# Altium schematic sheet Project_Information.SchDoc: =project_title
size Tabloid; CompanyName: Luxonis Holding; Organization: Luxonis Holding; Address1: 1925 Harmony Park Drive; Address2: Westminster, CO; Address3: 80234; Address4: United States; SheetNumber: 1; SheetTotal: 9
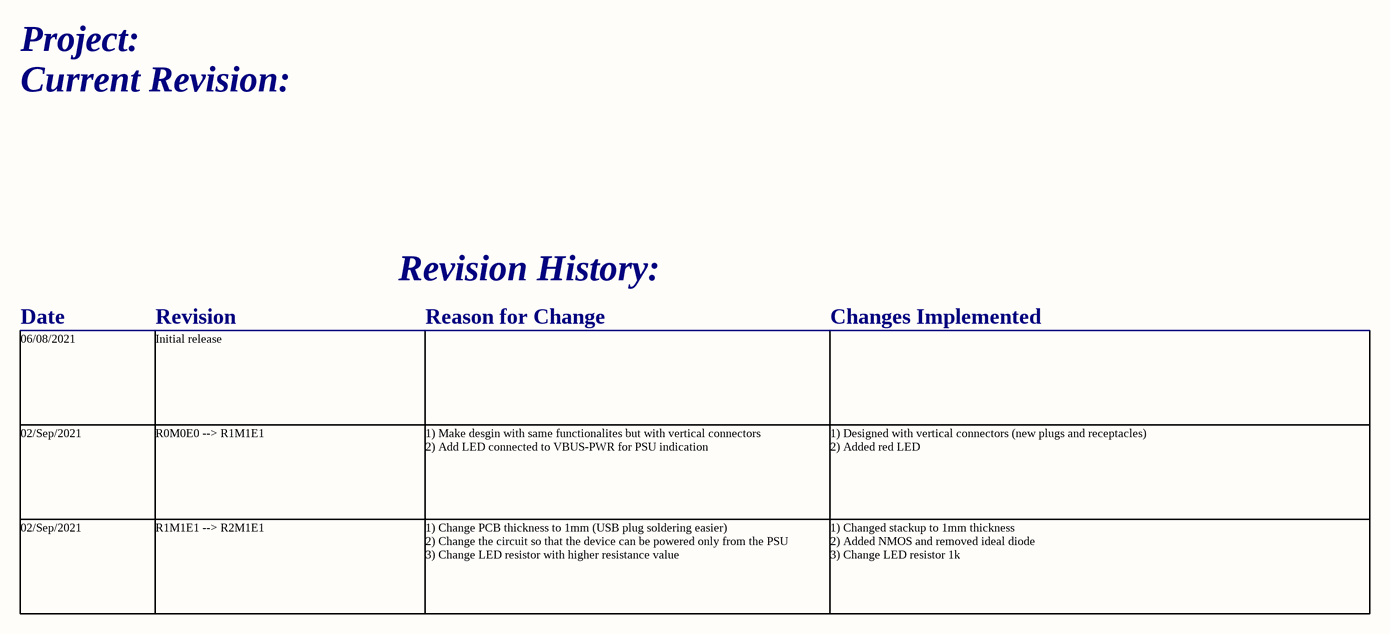
[diagram p0: Project_Information.SchDoc]

## Notes on the sheet
- Project:
- Current Revision:
- Revision History:
- Date
- Revision
- Reason for Change
- Changes Implemented
- 06/08/2021
- Initial release
- 02/Sep/2021
- R0M0E0 --> R1M1E1
- 1) Make desgin with same functionalites but with vertical connectors
  2) Add LED connected to VBUS-PWR for PSU indication
- 1) Designed with vertical connectors (new plugs and receptacles)
  2) Added red LED
- R1M1E1 --> R2M1E1
- 1) Change PCB thickness to 1mm (USB plug soldering easier)
  2) Change the circuit so that the device can be powered only from the PSU
  3) Change LED resistor with higher resistance value
- 1) Changed stackup to 1mm thickness
  2) Added NMOS and removed ideal diode
  3) Change LED resistor 1k
- Title
- Size:
- Date:
- Tabloid
- Number:
- Time:
- Revision:
- Sheet
- of
- Drawn by: